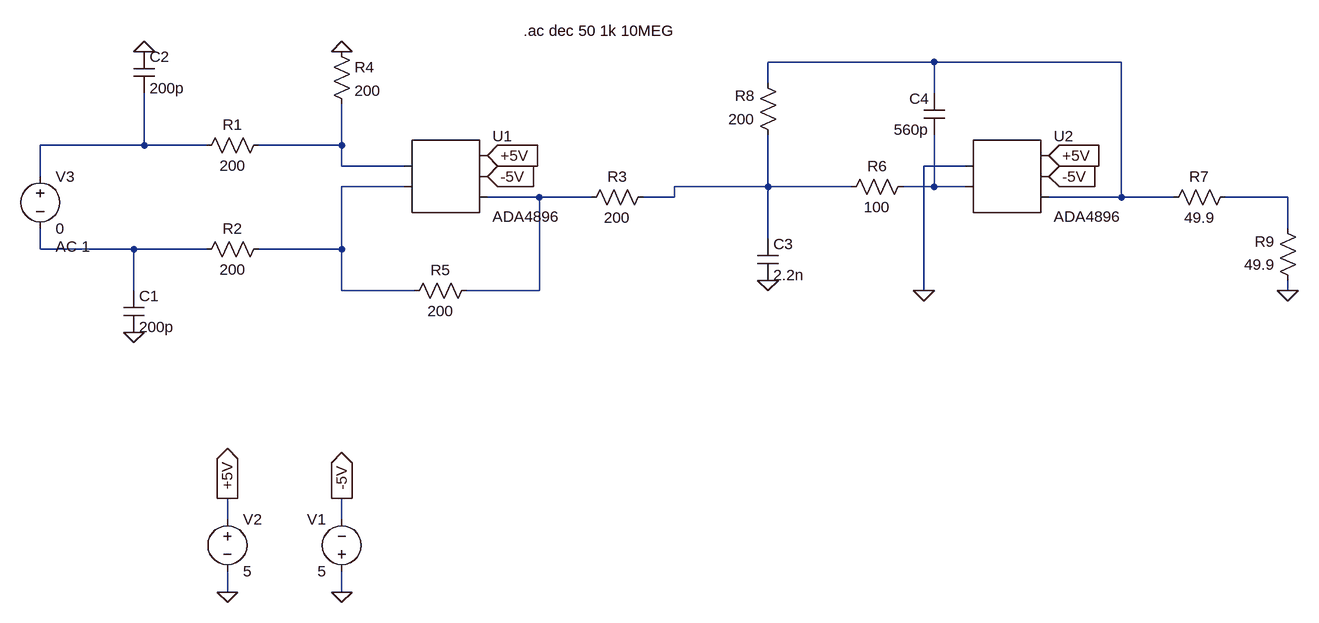
[diagram p0: schematic Rev1.0.asc]
Rev1.0.asc, the LTspice schematic file:
Version 4
SHEET 1 1540 824
WIRE 976 -32 720 -32
WIRE 1264 -32 976 -32
WIRE 720 0 720 -32
WIRE 976 16 976 -32
WIRE -240 96 -240 16
WIRE -240 96 -400 96
WIRE -144 96 -240 96
WIRE 64 96 64 32
WIRE 64 96 -64 96
WIRE 64 128 64 96
WIRE 160 128 64 128
WIRE 1024 128 960 128
WIRE -400 144 -400 96
WIRE 160 160 64 160
WIRE 720 160 720 80
WIRE 720 160 576 160
WIRE 848 160 720 160
WIRE 976 160 976 80
WIRE 976 160 928 160
WIRE 1024 160 976 160
WIRE 368 176 288 176
WIRE 448 176 368 176
WIRE 576 176 576 160
WIRE 576 176 528 176
WIRE 1264 176 1264 -32
WIRE 1264 176 1152 176
WIRE 1344 176 1264 176
WIRE 1520 176 1424 176
WIRE 1520 224 1520 176
WIRE 720 240 720 160
WIRE -400 256 -400 224
WIRE -256 256 -400 256
WIRE -144 256 -256 256
WIRE 64 256 64 160
WIRE 64 256 -64 256
WIRE -256 320 -256 256
WIRE 64 320 64 256
WIRE 176 320 64 320
WIRE 368 320 368 176
WIRE 368 320 256 320
WIRE 960 320 960 128
WIRE 1520 320 1520 304
WIRE -112 672 -112 640
WIRE 64 672 64 640
WIRE -112 784 -112 752
WIRE 64 784 64 752
FLAG -112 784 0
FLAG 64 784 0
FLAG 64 -48 0
FLAG -256 384 0
FLAG -240 -48 0
FLAG -112 640 +5V
IOPIN -112 640 Out
FLAG 64 640 -5V
IOPIN 64 640 Out
FLAG 288 112 +5V
IOPIN 288 112 In
FLAG 1152 112 +5V
IOPIN 1152 112 In
FLAG 288 144 -5V
IOPIN 288 144 In
FLAG 1152 144 -5V
IOPIN 1152 144 In
FLAG 720 304 0
FLAG 960 320 0
FLAG 1520 320 0
SYMBOL AutoGenerated\\ADA4896 224 144 R0
SYMATTR InstName U1
SYMBOL voltage 64 768 R180
WINDOW 0 24 96 Left 2
WINDOW 3 24 16 Left 2
WINDOW 123 0 0 Left 0
WINDOW 39 0 0 Left 0
SYMATTR InstName V1
SYMATTR Value 5
SYMBOL voltage -112 656 R0
WINDOW 123 0 0 Left 0
WINDOW 39 0 0 Left 0
SYMATTR InstName V2
SYMATTR Value 5
SYMBOL voltage -400 128 R0
WINDOW 123 24 124 Left 2
WINDOW 39 0 0 Left 0
SYMATTR Value2 AC 1
SYMATTR InstName V3
SYMATTR Value 0
SYMBOL res -48 80 R90
WINDOW 0 0 56 VBottom 2
WINDOW 3 32 56 VTop 2
SYMATTR InstName R1
SYMATTR Value 200
SYMBOL res -48 240 R90
WINDOW 0 0 56 VBottom 2
WINDOW 3 32 56 VTop 2
SYMATTR InstName R2
SYMATTR Value 200
SYMBOL res 544 160 R90
WINDOW 0 0 56 VBottom 2
WINDOW 3 32 56 VTop 2
SYMATTR InstName R3
SYMATTR Value 200
SYMBOL res 48 -64 R0
SYMATTR InstName R4
SYMATTR Value 200
SYMBOL res 160 336 R270
WINDOW 0 32 56 VTop 2
WINDOW 3 0 56 VBottom 2
SYMATTR InstName R5
SYMATTR Value 200
SYMBOL cap -272 320 R0
SYMATTR InstName C1
SYMATTR Value 200p
SYMBOL cap -256 -48 R0
SYMATTR InstName C2
SYMATTR Value 200p
SYMBOL cap 704 240 R0
SYMATTR InstName C3
SYMATTR Value 2.2n
SYMBOL cap 992 80 R180
WINDOW 0 24 56 Left 2
WINDOW 3 24 8 Left 2
SYMATTR InstName C4
SYMATTR Value 560p
SYMBOL AutoGenerated\\ADA4896 1088 144 R0
SYMATTR InstName U2
SYMBOL res 944 144 R90
WINDOW 0 0 56 VBottom 2
WINDOW 3 32 56 VTop 2
SYMATTR InstName R6
SYMATTR Value 100
SYMBOL res 736 96 R180
WINDOW 0 36 76 Left 2
WINDOW 3 36 40 Left 2
SYMATTR InstName R8
SYMATTR Value 200
SYMBOL res 1440 160 R90
WINDOW 0 0 56 VBottom 2
WINDOW 3 32 56 VTop 2
SYMATTR InstName R7
SYMATTR Value 49.9
SYMBOL res 1536 320 R180
WINDOW 0 36 76 Left 2
WINDOW 3 36 40 Left 2
SYMATTR InstName R9
SYMATTR Value 49.9
TEXT 344 -80 Left 2 !.ac dec 50 1k 10MEG

The netlist it stands for:
* Rev1.0.asc
* U1: ADA4896 (symbol AutoGenerated\ADA4896 not available, pins judged from their places): pin1=N003 pin2=N004 pin3=+5V pin4=-5V pin5=N007
V1 0 -5V 5
V2 +5V 0 5
V3 N002 N009 0 AC 1
R1 N003 N002 200
R2 N004 N009 200
R3 N005 N007 200
R4 0 N003 200
R5 N004 N007 200
C1 N009 0 200p
C2 0 N002 200p
C3 N005 0 2.2n
C4 N006 N001 560p
* U2: ADA4896 (symbol AutoGenerated\ADA4896 not available, pins judged from their places): pin1=0 pin2=N006 pin3=+5V pin4=-5V pin5=N001
R6 N006 N005 100
R8 N005 N001 200
R7 N008 N001 49.9
R9 0 N008 49.9
.ac dec 50 1k 10MEG
.backanno
.end